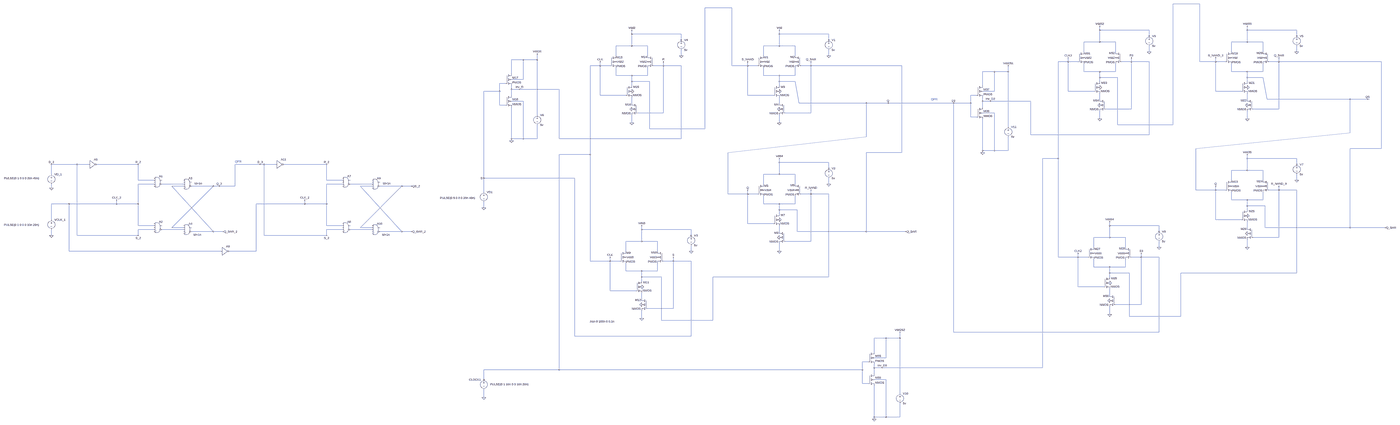
[diagram p0: schematic Flip-Flop-D-negedge.asc, whole sheet]
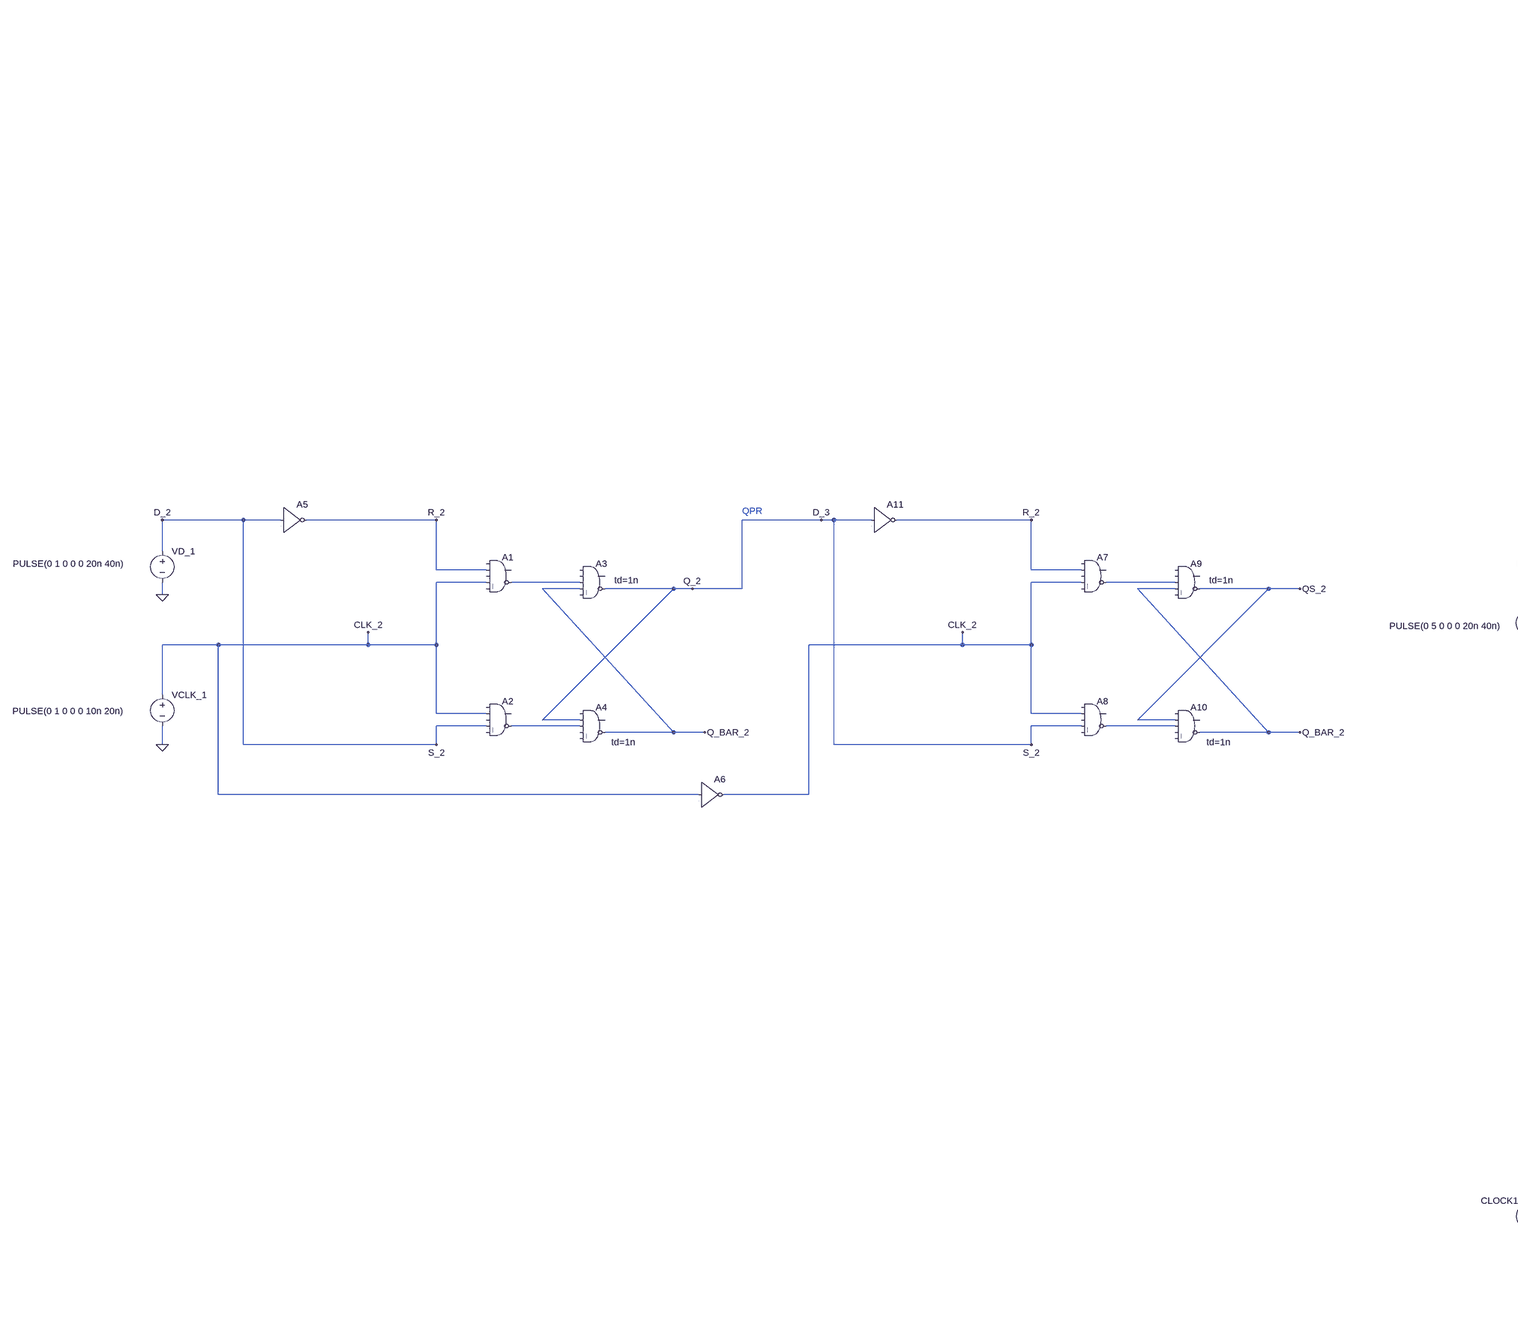
[diagram p1: schematic Flip-Flop-D-negedge.asc, part, row 1 of 1, column 1 of 3]
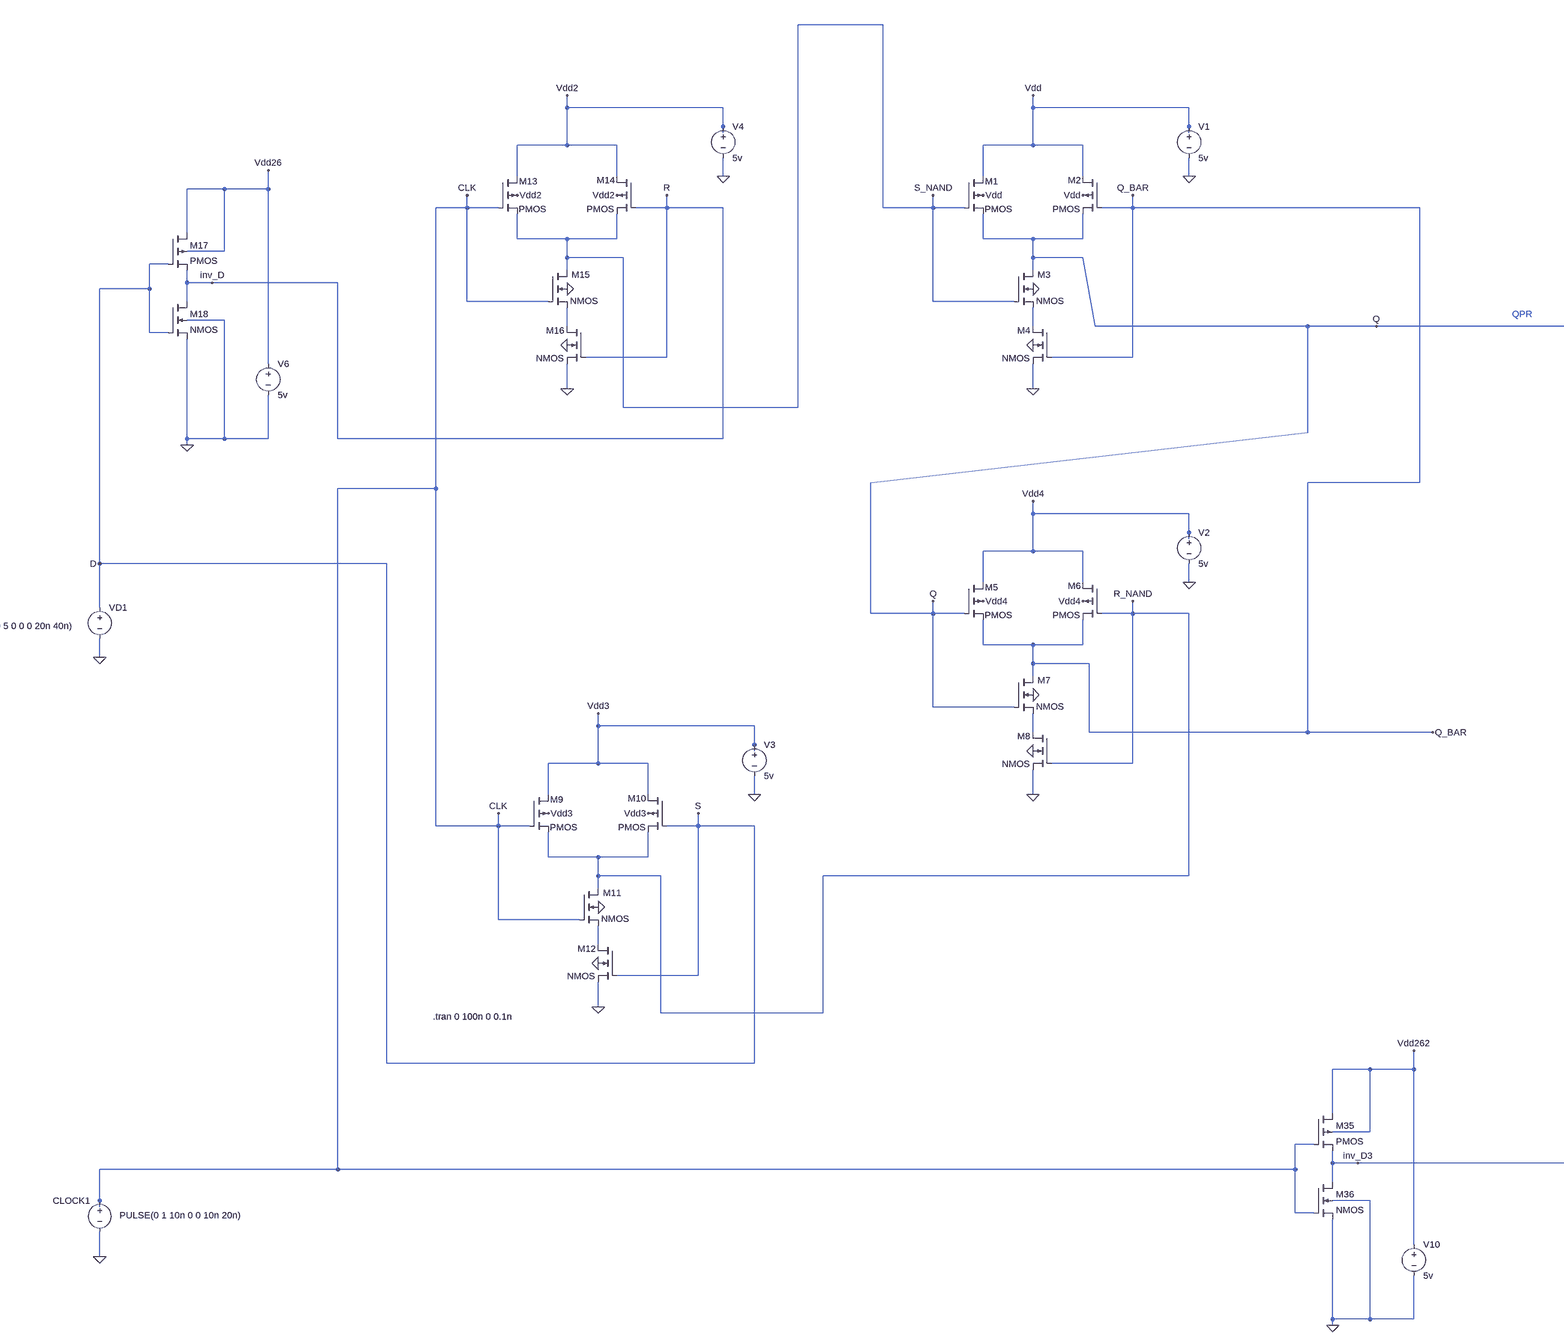
[diagram p2: schematic Flip-Flop-D-negedge.asc, part, row 1 of 1, column 2 of 3]
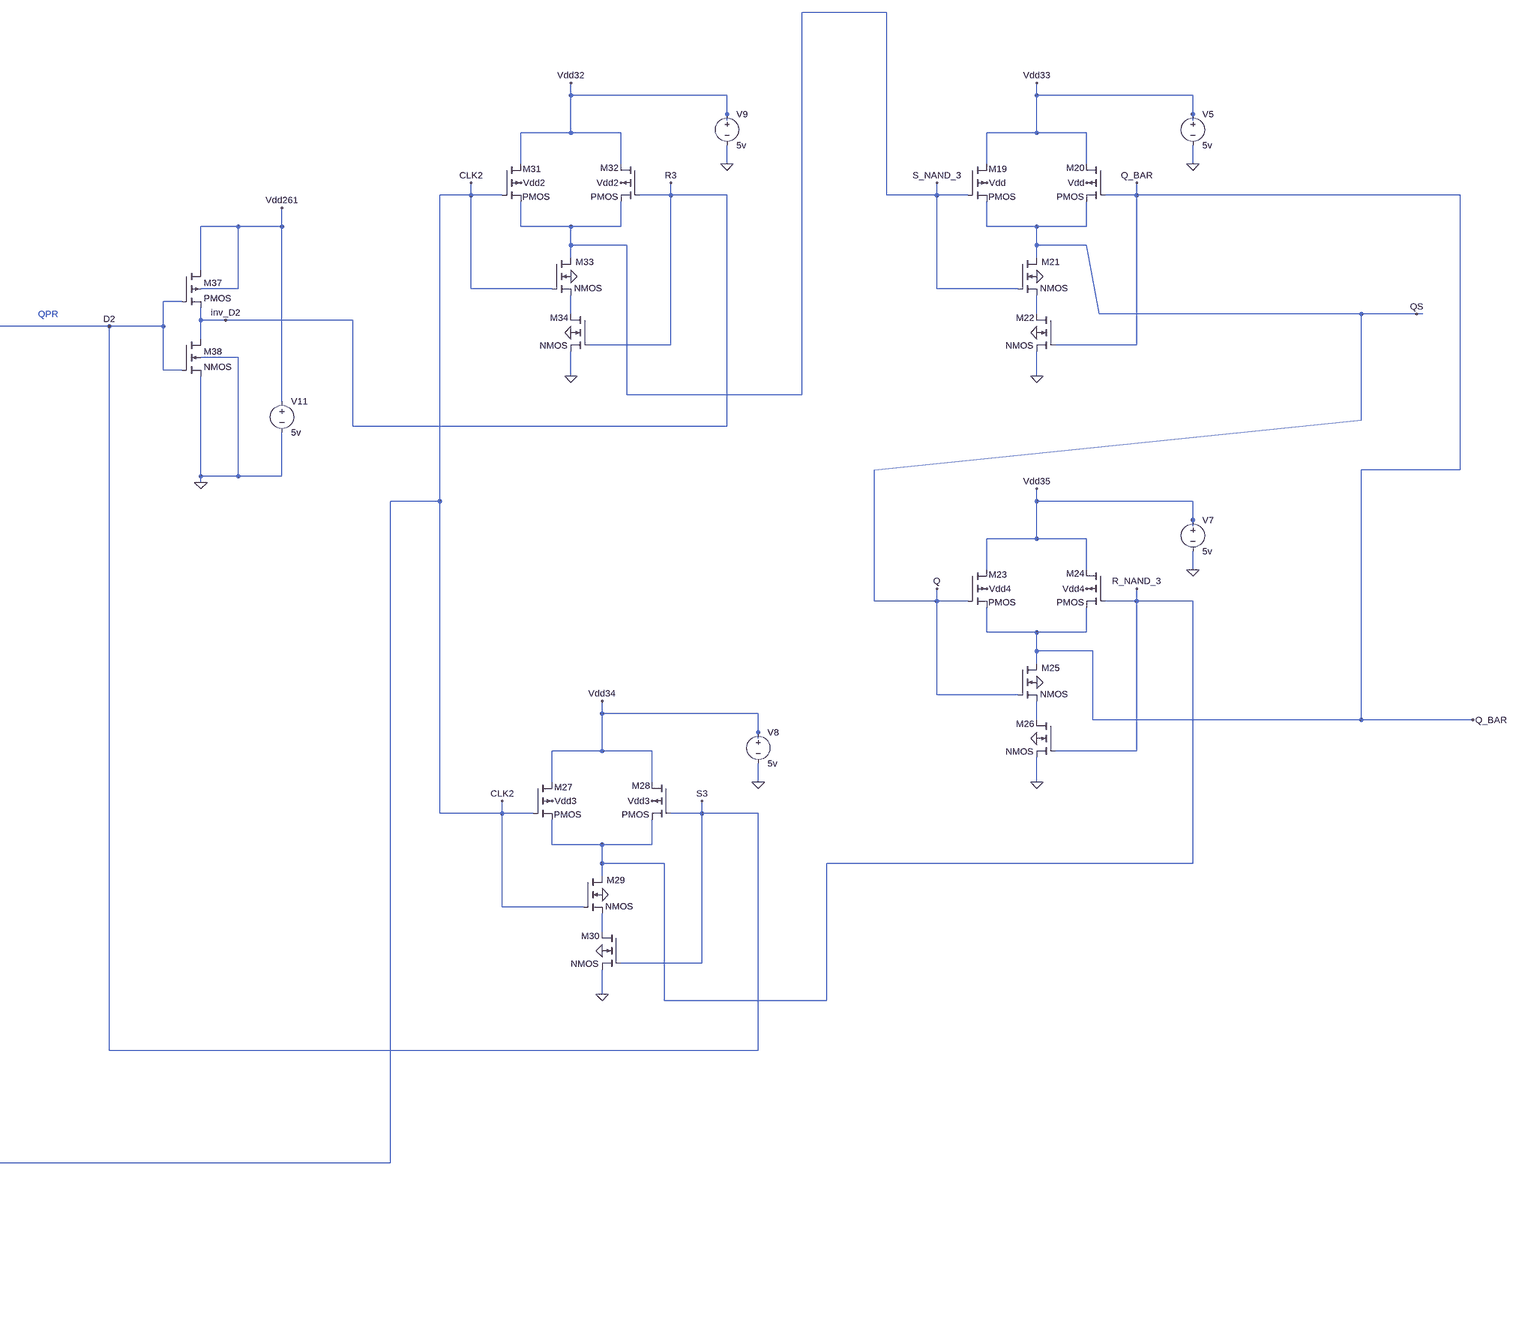
[diagram p3: schematic Flip-Flop-D-negedge.asc, part, row 1 of 1, column 3 of 3]
Flip-Flop-D-negedge.asc, the LTspice schematic file:
Version 4
SHEET 1 8836 2388
WIRE 7200 -1056 6352 -1056
WIRE 1920 -1024 1312 -1024
WIRE 5760 -784 5760 -816
WIRE 6160 -784 5760 -784
WIRE 7584 -784 7584 -816
WIRE 7984 -784 7584 -784
WIRE 720 -752 720 -784
WIRE 1120 -752 720 -752
WIRE 2304 -752 2304 -784
WIRE 2704 -752 2304 -752
WIRE 6160 -736 6160 -784
WIRE 7984 -736 7984 -784
WIRE 6160 -720 6160 -736
WIRE 7984 -720 7984 -736
WIRE 1120 -704 1120 -752
WIRE 2704 -704 2704 -752
WIRE 1120 -688 1120 -704
WIRE 2704 -688 2704 -704
WIRE 5760 -688 5760 -784
WIRE 5760 -688 5632 -688
WIRE 5888 -688 5760 -688
WIRE 7584 -688 7584 -784
WIRE 7584 -688 7456 -688
WIRE 7712 -688 7584 -688
WIRE 720 -656 720 -752
WIRE 720 -656 592 -656
WIRE 848 -656 720 -656
WIRE 2304 -656 2304 -752
WIRE 2304 -656 2176 -656
WIRE 2432 -656 2304 -656
WIRE 5632 -608 5632 -688
WIRE 5888 -608 5888 -688
WIRE 6160 -608 6160 -656
WIRE 7456 -608 7456 -688
WIRE 7712 -608 7712 -688
WIRE 7984 -608 7984 -656
WIRE 592 -576 592 -656
WIRE 848 -576 848 -656
WIRE 1120 -576 1120 -624
WIRE 2176 -576 2176 -656
WIRE 2432 -576 2432 -656
WIRE 2704 -576 2704 -624
WIRE -544 -544 -640 -544
WIRE -432 -544 -432 -592
WIRE -432 -544 -544 -544
WIRE 5504 -528 5504 -560
WIRE 5504 -528 5424 -528
WIRE 5584 -528 5504 -528
WIRE 6016 -528 6016 -560
WIRE 6016 -528 5936 -528
WIRE 6160 -528 6016 -528
WIRE 7200 -528 7200 -1056
WIRE 7328 -528 7328 -560
WIRE 7328 -528 7200 -528
WIRE 7408 -528 7328 -528
WIRE 7840 -528 7840 -560
WIRE 7840 -528 7760 -528
WIRE 8704 -528 7840 -528
WIRE 464 -496 464 -528
WIRE 464 -496 384 -496
WIRE 544 -496 464 -496
WIRE 976 -496 976 -528
WIRE 976 -496 896 -496
WIRE 1120 -496 976 -496
WIRE 1920 -496 1920 -1024
WIRE 2048 -496 2048 -528
WIRE 2048 -496 1920 -496
WIRE 2128 -496 2048 -496
WIRE 2560 -496 2560 -528
WIRE 2560 -496 2480 -496
WIRE 3296 -496 2560 -496
WIRE 4208 -448 4112 -448
WIRE 4320 -448 4320 -496
WIRE 4320 -448 4208 -448
WIRE 5632 -448 5632 -512
WIRE 5760 -448 5632 -448
WIRE 5888 -448 5888 -512
WIRE 5888 -448 5760 -448
WIRE 7456 -448 7456 -512
WIRE 7584 -448 7456 -448
WIRE 7712 -448 7712 -512
WIRE 7712 -448 7584 -448
WIRE -640 -432 -640 -544
WIRE 592 -416 592 -480
WIRE 720 -416 592 -416
WIRE 848 -416 848 -480
WIRE 848 -416 720 -416
WIRE 2176 -416 2176 -480
WIRE 2304 -416 2176 -416
WIRE 2432 -416 2432 -480
WIRE 2432 -416 2304 -416
WIRE 5760 -400 5760 -448
WIRE 5904 -400 5760 -400
WIRE 7584 -400 7584 -448
WIRE 7712 -400 7584 -400
WIRE -544 -384 -544 -544
WIRE -544 -384 -640 -384
WIRE 720 -368 720 -416
WIRE 864 -368 720 -368
WIRE 2304 -368 2304 -416
WIRE 2432 -368 2304 -368
WIRE 5760 -368 5760 -400
WIRE 7584 -368 7584 -400
WIRE -688 -352 -736 -352
WIRE 720 -336 720 -368
WIRE 2304 -336 2304 -368
WIRE 4112 -336 4112 -448
WIRE -640 -304 -640 -336
WIRE -576 -304 -640 -304
WIRE -96 -304 -576 -304
WIRE -736 -288 -736 -352
WIRE -736 -288 -864 -288
WIRE 4208 -288 4208 -448
WIRE 4208 -288 4112 -288
WIRE 5504 -288 5504 -528
WIRE 5712 -288 5504 -288
WIRE 7328 -288 7328 -528
WIRE 7536 -288 7328 -288
WIRE -640 -256 -640 -304
WIRE 464 -256 464 -496
WIRE 672 -256 464 -256
WIRE 2048 -256 2048 -496
WIRE 2256 -256 2048 -256
WIRE 4064 -256 4016 -256
WIRE 5760 -224 5760 -272
WIRE 7584 -224 7584 -272
WIRE 7744 -224 7712 -400
WIRE 8416 -224 7744 -224
WIRE 8592 -224 8416 -224
WIRE 8608 -224 8592 -224
WIRE -544 -208 -640 -208
WIRE 4112 -208 4112 -240
WIRE 4176 -208 4112 -208
WIRE 4944 -208 4176 -208
WIRE 720 -192 720 -240
WIRE 2304 -192 2304 -240
WIRE 2464 -192 2432 -368
WIRE 3008 -192 2464 -192
WIRE 3184 -192 3008 -192
WIRE 3872 -192 3184 -192
WIRE 4016 -192 4016 -256
WIRE 4016 -192 3872 -192
WIRE -736 -176 -736 -288
WIRE -688 -176 -736 -176
WIRE 4112 -160 4112 -208
WIRE 6016 -144 6016 -528
WIRE 6016 -144 5808 -144
WIRE 7840 -144 7840 -528
WIRE 7840 -144 7632 -144
WIRE 976 -112 976 -496
WIRE 976 -112 768 -112
WIRE 2560 -112 2560 -496
WIRE 2560 -112 2352 -112
WIRE 4208 -112 4112 -112
WIRE -432 -96 -432 -544
WIRE 4016 -80 4016 -192
WIRE 4064 -80 4016 -80
WIRE 5760 -64 5760 -128
WIRE 7584 -64 7584 -128
WIRE 720 -32 720 -96
WIRE 2304 -32 2304 -96
WIRE 5904 -16 5904 -400
WIRE 6352 -16 6352 -1056
WIRE 6352 -16 5904 -16
WIRE 4320 0 4320 -448
WIRE 864 16 864 -368
WIRE 1312 16 1312 -1024
WIRE 1312 16 864 16
WIRE 8416 48 8416 -224
WIRE 4944 64 4944 -208
WIRE 6160 64 6160 -528
WIRE 6160 64 4944 64
WIRE 3008 80 3008 -192
WIRE -640 96 -640 -160
WIRE -544 96 -544 -208
WIRE -544 96 -640 96
WIRE -432 96 -432 -16
WIRE -432 96 -544 96
WIRE -96 96 -96 -304
WIRE 1120 96 1120 -496
WIRE 1120 96 -96 96
WIRE -640 112 -640 96
WIRE 7168 176 8416 48
WIRE 8704 176 8704 -528
WIRE 8704 176 8416 176
WIRE 4112 192 4112 -64
WIRE 4208 192 4208 -112
WIRE 4208 192 4112 192
WIRE 4320 192 4320 80
WIRE 4320 192 4208 192
WIRE 1888 208 3008 80
WIRE 3296 208 3296 -496
WIRE 3296 208 3008 208
WIRE 4112 208 4112 192
WIRE 384 224 384 -496
WIRE 384 224 -96 224
WIRE 5424 256 5424 -528
WIRE 5424 256 5040 256
WIRE 7584 256 7584 224
WIRE 7984 256 7584 256
WIRE 2304 288 2304 256
WIRE 2704 288 2304 288
WIRE -7376 304 -7584 304
WIRE -7280 304 -7376 304
WIRE -6768 304 -7216 304
WIRE -5712 304 -5984 304
WIRE -5680 304 -5712 304
WIRE -5584 304 -5680 304
WIRE -5072 304 -5520 304
WIRE 7984 304 7984 256
WIRE 7984 320 7984 304
WIRE 2704 336 2704 288
WIRE 2704 352 2704 336
WIRE 7584 352 7584 256
WIRE 7584 352 7456 352
WIRE 7712 352 7584 352
WIRE -7584 384 -7584 304
WIRE 2304 384 2304 288
WIRE 2304 384 2176 384
WIRE 2432 384 2304 384
WIRE -864 416 -864 -288
WIRE 64 416 -864 416
WIRE -6768 432 -6768 304
WIRE -6640 432 -6768 432
WIRE -5072 432 -5072 304
WIRE -4944 432 -5072 432
WIRE 7456 432 7456 352
WIRE 7712 432 7712 352
WIRE 7984 432 7984 384
WIRE -6640 464 -6768 464
WIRE -6400 464 -6576 464
WIRE -4944 464 -5072 464
WIRE -4704 464 -4880 464
WIRE 2176 464 2176 384
WIRE 2432 464 2432 384
WIRE 2704 464 2704 416
WIRE -6400 480 -6496 480
WIRE -6160 480 -6336 480
WIRE -6112 480 -6160 480
WIRE -5984 480 -5984 304
WIRE -5984 480 -6112 480
WIRE -4704 480 -4800 480
WIRE -4464 480 -4640 480
WIRE -4384 480 -4464 480
WIRE -7584 496 -7584 464
WIRE 7168 512 7168 176
WIRE 7328 512 7328 480
WIRE 7328 512 7168 512
WIRE 7408 512 7328 512
WIRE 7840 512 7840 480
WIRE 7840 512 7760 512
WIRE 7984 512 7840 512
WIRE -864 528 -864 416
WIRE 1888 544 1888 208
WIRE 2048 544 2048 512
WIRE 2048 544 1888 544
WIRE 2128 544 2048 544
WIRE 2560 544 2560 512
WIRE 2560 544 2480 544
WIRE 2704 544 2560 544
WIRE 7456 592 7456 528
WIRE 7584 592 7456 592
WIRE 7712 592 7712 528
WIRE 7712 592 7584 592
WIRE -7440 624 -7584 624
WIRE -6960 624 -6960 592
WIRE -6960 624 -7440 624
WIRE -6768 624 -6768 464
WIRE -6768 624 -6960 624
WIRE -5264 624 -5264 592
WIRE -5264 624 -5744 624
WIRE -5072 624 -5072 464
WIRE -5072 624 -5264 624
WIRE 2176 624 2176 560
WIRE 2304 624 2176 624
WIRE 2432 624 2432 560
WIRE 2432 624 2304 624
WIRE 7584 640 7584 592
WIRE 7728 640 7584 640
WIRE -864 656 -864 608
WIRE 2304 672 2304 624
WIRE 2448 672 2304 672
WIRE 7584 672 7584 640
WIRE 2304 704 2304 672
WIRE -7584 752 -7584 624
WIRE 7328 752 7328 512
WIRE 7536 752 7328 752
WIRE 2048 784 2048 544
WIRE 2256 784 2048 784
WIRE -6768 800 -6768 624
WIRE -6640 800 -6768 800
WIRE -5072 800 -5072 624
WIRE -4944 800 -5072 800
WIRE 5840 800 5840 768
WIRE 6240 800 5840 800
WIRE -6496 816 -6160 480
WIRE -6400 816 -6496 816
WIRE -4800 816 -4464 480
WIRE -4704 816 -4800 816
WIRE 7584 816 7584 768
WIRE 7728 816 7728 640
WIRE 8416 816 8416 176
WIRE 8416 816 7728 816
WIRE 8736 816 8416 816
WIRE -6640 832 -6768 832
WIRE -6400 832 -6576 832
WIRE -4944 832 -5072 832
WIRE -4704 832 -4880 832
WIRE 800 832 800 800
WIRE 1200 832 800 832
WIRE -6160 848 -6496 480
WIRE -6160 848 -6336 848
WIRE -6080 848 -6160 848
WIRE -4464 848 -4800 480
WIRE -4464 848 -4640 848
WIRE -4384 848 -4464 848
WIRE 2304 848 2304 800
WIRE 2448 848 2448 672
WIRE 3008 848 3008 208
WIRE 3008 848 2448 848
WIRE 3328 848 3008 848
WIRE 6240 848 6240 800
WIRE 6240 864 6240 848
WIRE -7584 880 -7584 832
WIRE -7376 880 -7376 304
WIRE -6768 880 -6768 832
WIRE -6768 880 -7376 880
WIRE -5680 880 -5680 304
WIRE -5072 880 -5072 832
WIRE -5072 880 -5680 880
WIRE 1200 880 1200 832
WIRE 1200 896 1200 880
WIRE 5840 896 5840 800
WIRE 5840 896 5712 896
WIRE 5968 896 5840 896
WIRE 7840 896 7840 512
WIRE 7840 896 7632 896
WIRE 800 928 800 832
WIRE 800 928 672 928
WIRE 928 928 800 928
WIRE 2560 928 2560 544
WIRE 2560 928 2352 928
WIRE 5712 976 5712 896
WIRE 5968 976 5968 896
WIRE 6240 976 6240 928
WIRE 7584 976 7584 912
WIRE -7440 1008 -7440 624
WIRE -6096 1008 -7440 1008
WIRE -5744 1008 -5744 624
WIRE -5744 1008 -6032 1008
WIRE 672 1008 672 928
WIRE 928 1008 928 928
WIRE 1200 1008 1200 960
WIRE 2304 1008 2304 944
WIRE 5424 1056 5424 256
WIRE 5584 1056 5584 1024
WIRE 5584 1056 5424 1056
WIRE 5664 1056 5584 1056
WIRE 6096 1056 6096 1024
WIRE 6096 1056 6016 1056
WIRE 6240 1056 6096 1056
WIRE 384 1088 384 224
WIRE 544 1088 544 1056
WIRE 544 1088 384 1088
WIRE 624 1088 544 1088
WIRE 1056 1088 1056 1056
WIRE 1056 1088 976 1088
WIRE 1200 1088 1056 1088
WIRE 5712 1136 5712 1072
WIRE 5840 1136 5712 1136
WIRE 5968 1136 5968 1072
WIRE 5968 1136 5840 1136
WIRE 672 1168 672 1104
WIRE 800 1168 672 1168
WIRE 928 1168 928 1104
WIRE 928 1168 800 1168
WIRE 5840 1184 5840 1136
WIRE 6000 1184 5840 1184
WIRE 7984 1184 7984 512
WIRE 7984 1184 6416 1184
WIRE 800 1216 800 1168
WIRE 960 1216 800 1216
WIRE 2704 1216 2704 544
WIRE 2704 1216 1376 1216
WIRE 5840 1216 5840 1184
WIRE 800 1248 800 1216
WIRE 5584 1296 5584 1056
WIRE 5792 1296 5584 1296
WIRE 544 1328 544 1088
WIRE 752 1328 544 1328
WIRE 5840 1360 5840 1312
WIRE 800 1392 800 1344
WIRE 6096 1440 6096 1056
WIRE 6096 1440 5888 1440
WIRE 1056 1472 1056 1088
WIRE 1056 1472 848 1472
WIRE 5840 1520 5840 1456
WIRE 6000 1536 6000 1184
WIRE 6416 1536 6416 1184
WIRE 6416 1536 6000 1536
WIRE 800 1552 800 1488
WIRE 960 1568 960 1216
WIRE 1376 1568 1376 1216
WIRE 1376 1568 960 1568
WIRE 3872 1664 3872 -192
WIRE 6240 1664 6240 1056
WIRE 6240 1664 3872 1664
WIRE 64 1696 64 416
WIRE 1200 1696 1200 1088
WIRE 1200 1696 64 1696
WIRE 3168 1712 3072 1712
WIRE 3280 1712 3280 1664
WIRE 3280 1712 3168 1712
WIRE 3072 1824 3072 1712
WIRE 3168 1872 3168 1712
WIRE 3168 1872 3072 1872
WIRE 3024 1904 2976 1904
WIRE 3072 1952 3072 1920
WIRE 3136 1952 3072 1952
WIRE 5040 1952 5040 256
WIRE 5040 1952 3136 1952
WIRE -96 1968 -96 224
WIRE -96 1968 -864 1968
WIRE 2976 1968 2976 1904
WIRE 2976 1968 -96 1968
WIRE 3072 2000 3072 1952
WIRE -864 2048 -864 1968
WIRE 3168 2048 3072 2048
WIRE -864 2064 -864 2048
WIRE 2976 2080 2976 1968
WIRE 3024 2080 2976 2080
WIRE 3280 2160 3280 1712
WIRE -864 2192 -864 2128
WIRE 3072 2352 3072 2096
WIRE 3168 2352 3168 2048
WIRE 3168 2352 3072 2352
WIRE 3280 2352 3280 2240
WIRE 3280 2352 3168 2352
WIRE 3072 2368 3072 2352
FLAG 2304 -32 0
FLAG 2304 -784 Vdd
FLAG 2176 -528 Vdd
FLAG 2432 -528 Vdd
FLAG 2048 -528 S_NAND
FLAG 2560 -528 Q_BAR
FLAG 2704 -576 0
FLAG 2304 -288 0
FLAG 2304 -144 0
FLAG 2304 1008 0
FLAG 2304 256 Vdd4
FLAG 2176 512 Vdd4
FLAG 2432 512 Vdd4
FLAG 2048 512 Q
FLAG 2560 512 R_NAND
FLAG 2704 464 0
FLAG 2304 752 0
FLAG 2304 896 0
FLAG 3184 -192 Q
FLAG 3328 848 Q_BAR
FLAG 800 1552 0
FLAG 800 800 Vdd3
FLAG 672 1056 Vdd3
FLAG 928 1056 Vdd3
FLAG 544 1056 CLK
FLAG 1056 1056 S
FLAG 1200 1008 0
FLAG 800 1296 0
FLAG 800 1440 0
FLAG 720 -32 0
FLAG -864 656 0
FLAG -864 2192 0
FLAG 720 -784 Vdd2
FLAG 592 -528 Vdd2
FLAG 848 -528 Vdd2
FLAG 464 -528 CLK
FLAG 976 -528 R
FLAG 1120 -576 0
FLAG 720 -288 0
FLAG 720 -144 0
FLAG -6112 480 Q_2
FLAG -6080 848 Q_BAR_2
FLAG -7584 880 0
FLAG -6960 592 CLK_2
FLAG -7584 496 0
FLAG -6768 304 R_2
FLAG -6768 880 S_2
FLAG -7584 304 D_2
FLAG -640 112 0
FLAG -432 -592 Vdd26
FLAG -576 -304 inv_D
FLAG -864 416 D
FLAG -4384 480 QS_2
FLAG -4384 848 Q_BAR_2
FLAG -5264 592 CLK_2
FLAG -5072 304 R_2
FLAG -5072 880 S_2
FLAG -5712 304 D_3
FLAG 7584 -64 0
FLAG 7584 -816 Vdd33
FLAG 7456 -560 Vdd
FLAG 7712 -560 Vdd
FLAG 7328 -560 S_NAND_3
FLAG 7840 -560 Q_BAR
FLAG 7984 -608 0
FLAG 7584 -320 0
FLAG 7584 -176 0
FLAG 7584 976 0
FLAG 7584 224 Vdd35
FLAG 7456 480 Vdd4
FLAG 7712 480 Vdd4
FLAG 7328 480 Q
FLAG 7840 480 R_NAND_3
FLAG 7984 432 0
FLAG 7584 720 0
FLAG 7584 864 0
FLAG 8592 -224 QS
FLAG 8736 816 Q_BAR
FLAG 5840 1520 0
FLAG 5840 768 Vdd34
FLAG 5712 1024 Vdd3
FLAG 5968 1024 Vdd3
FLAG 5584 1024 CLK2
FLAG 6096 1024 S3
FLAG 6240 976 0
FLAG 5840 1264 0
FLAG 5840 1408 0
FLAG 5760 -64 0
FLAG 5760 -816 Vdd32
FLAG 5632 -560 Vdd2
FLAG 5888 -560 Vdd2
FLAG 5504 -560 CLK2
FLAG 6016 -560 R3
FLAG 6160 -608 0
FLAG 5760 -320 0
FLAG 5760 -176 0
FLAG 3072 2368 0
FLAG 3280 1664 Vdd262
FLAG 3136 1952 inv_D3
FLAG 4112 208 0
FLAG 4320 -496 Vdd261
FLAG 4176 -208 inv_D2
FLAG 3872 -192 D2
SYMBOL pmos4 2128 -576 R0
WINDOW 0 53 12 Left 2
WINDOW 3 52 83 Left 2
SYMATTR InstName M1
SYMATTR Value2 l=0.6u w=6u
SYMBOL pmos4 2480 -576 M0
WINDOW 0 53 9 Left 2
WINDOW 3 55 83 Left 2
SYMATTR InstName M2
SYMATTR Value2 l=0.6u w=6u
SYMBOL nmos4 2256 -336 R0
WINDOW 0 60 11 Left 2
WINDOW 3 56 78 Left 2
SYMATTR InstName M3
SYMATTR Value2 l=0.6u w=3u
SYMBOL nmos4 2352 -192 M0
WINDOW 0 54 10 Left 2
WINDOW 3 56 81 Left 2
SYMATTR InstName M4
SYMATTR Value2 l=0.6u w=3u
SYMBOL voltage 2704 -720 R0
WINDOW 123 0 0 Left 0
WINDOW 39 0 0 Left 0
SYMATTR InstName V1
SYMATTR Value 5v
SYMBOL pmos4 2128 464 R0
WINDOW 0 53 12 Left 2
WINDOW 3 52 83 Left 2
SYMATTR InstName M5
SYMATTR Value2 l=0.6u w=6u
SYMBOL pmos4 2480 464 M0
WINDOW 0 53 9 Left 2
WINDOW 3 55 83 Left 2
SYMATTR InstName M6
SYMATTR Value2 l=0.6u w=6u
SYMBOL nmos4 2256 704 R0
WINDOW 0 60 11 Left 2
WINDOW 3 56 78 Left 2
SYMATTR InstName M7
SYMATTR Value2 l=0.6u w=3u
SYMBOL nmos4 2352 848 M0
WINDOW 0 54 10 Left 2
WINDOW 3 56 81 Left 2
SYMATTR InstName M8
SYMATTR Value2 l=0.6u w=3u
SYMBOL voltage 2704 320 R0
WINDOW 123 0 0 Left 0
WINDOW 39 0 0 Left 0
SYMATTR InstName V2
SYMATTR Value 5v
SYMBOL pmos4 624 1008 R0
WINDOW 0 53 12 Left 2
WINDOW 3 52 83 Left 2
SYMATTR InstName M9
SYMATTR Value2 l=0.6u w=6u
SYMBOL pmos4 976 1008 M0
WINDOW 0 53 9 Left 2
WINDOW 3 55 83 Left 2
SYMATTR InstName M10
SYMATTR Value2 l=0.6u w=6u
SYMBOL nmos4 752 1248 R0
WINDOW 0 60 11 Left 2
WINDOW 3 56 78 Left 2
SYMATTR InstName M11
SYMATTR Value2 l=0.6u w=3u
SYMBOL nmos4 848 1392 M0
WINDOW 0 54 10 Left 2
WINDOW 3 56 81 Left 2
SYMATTR InstName M12
SYMATTR Value2 l=0.6u w=3u
SYMBOL voltage 1200 864 R0
WINDOW 123 0 0 Left 0
WINDOW 39 0 0 Left 0
SYMATTR InstName V3
SYMATTR Value 5v
SYMBOL voltage -864 2032 M0
WINDOW 3 -361 53 Left 2
WINDOW 123 0 0 Left 0
WINDOW 39 0 0 Left 0
SYMATTR Value PULSE(0 1 10n 0 0 10n 20n)
SYMATTR InstName CLOCK1
SYMBOL pmos4 544 -576 R0
WINDOW 0 53 12 Left 2
WINDOW 3 52 83 Left 2
SYMATTR InstName M13
SYMATTR Value2 l=0.6u w=6u
SYMBOL pmos4 896 -576 M0
WINDOW 0 53 9 Left 2
WINDOW 3 55 83 Left 2
SYMATTR InstName M14
SYMATTR Value2 l=0.6u w=6u
SYMBOL nmos4 672 -336 R0
WINDOW 0 60 11 Left 2
WINDOW 3 56 78 Left 2
SYMATTR InstName M15
SYMATTR Value2 l=0.6u w=3u
SYMBOL nmos4 768 -192 M0
WINDOW 0 54 10 Left 2
WINDOW 3 56 81 Left 2
SYMATTR InstName M16
SYMATTR Value2 l=0.6u w=3u
SYMBOL voltage 1120 -720 R0
WINDOW 123 0 0 Left 0
WINDOW 39 0 0 Left 0
SYMATTR InstName V4
SYMATTR Value 5v
SYMBOL voltage -864 512 R0
WINDOW 3 -71 63 Right 2
WINDOW 123 0 0 Left 0
WINDOW 39 0 0 Left 0
SYMATTR Value PULSE(0 5 0 0 0 20n 40n)
SYMATTR InstName VD1
SYMBOL voltage -7584 736 R0
WINDOW 3 -384 57 Left 2
WINDOW 123 0 0 Left 0
WINDOW 39 0 0 Left 0
SYMATTR Value PULSE(0 1 0 0 0 10n 20n)
SYMATTR InstName VCLK_1
SYMBOL Digital\\and -6608 384 R0
SYMATTR InstName A1
SYMBOL Digital\\and -6608 752 R0
SYMATTR InstName A2
SYMBOL Digital\\and -6368 400 R0
WINDOW 3 56 58 Left 2
SYMATTR Value td=1n
SYMATTR InstName A3
SYMBOL Digital\\and -6368 768 R0
WINDOW 3 49 105 Left 2
SYMATTR Value td=1n
SYMATTR InstName A4
SYMBOL voltage -7584 368 R0
WINDOW 3 -383 48 Left 2
WINDOW 123 0 0 Left 0
WINDOW 39 0 0 Left 0
SYMATTR Value PULSE(0 1 0 0 0 20n 40n)
SYMATTR InstName VD_1
SYMBOL Digital\\inv -7280 240 R0
SYMATTR InstName A5
SYMBOL pmos4 -688 -432 R0
SYMATTR InstName M17
SYMATTR Value2 l=0.6u w=6u
SYMBOL nmos4 -688 -256 R0
SYMATTR InstName M18
SYMATTR Value2 l=0.6u w=3u
SYMBOL voltage -432 -112 R0
WINDOW 123 0 0 Left 0
WINDOW 39 0 0 Left 0
SYMATTR InstName V6
SYMATTR Value 5v
SYMBOL Digital\\inv -6096 944 R0
SYMATTR InstName A6
SYMBOL Digital\\and -4912 384 R0
SYMATTR InstName A7
SYMBOL Digital\\and -4912 752 R0
SYMATTR InstName A8
SYMBOL Digital\\and -4672 400 R0
WINDOW 3 56 58 Left 2
SYMATTR Value td=1n
SYMATTR InstName A9
SYMBOL Digital\\and -4672 768 R0
WINDOW 3 49 105 Left 2
SYMATTR Value td=1n
SYMATTR InstName A10
SYMBOL Digital\\inv -5584 240 R0
SYMATTR InstName A11
SYMBOL pmos4 7408 -608 R0
WINDOW 0 53 12 Left 2
WINDOW 3 52 83 Left 2
SYMATTR InstName M19
SYMATTR Value2 l=0.6u w=6u
SYMBOL pmos4 7760 -608 M0
WINDOW 0 53 9 Left 2
WINDOW 3 55 83 Left 2
SYMATTR InstName M20
SYMATTR Value2 l=0.6u w=6u
SYMBOL nmos4 7536 -368 R0
WINDOW 0 60 11 Left 2
WINDOW 3 56 78 Left 2
SYMATTR InstName M21
SYMATTR Value2 l=0.6u w=3u
SYMBOL nmos4 7632 -224 M0
WINDOW 0 54 10 Left 2
WINDOW 3 56 81 Left 2
SYMATTR InstName M22
SYMATTR Value2 l=0.6u w=3u
SYMBOL voltage 7984 -752 R0
WINDOW 123 0 0 Left 0
WINDOW 39 0 0 Left 0
SYMATTR InstName V5
SYMATTR Value 5v
SYMBOL pmos4 7408 432 R0
WINDOW 0 53 12 Left 2
WINDOW 3 52 83 Left 2
SYMATTR InstName M23
SYMATTR Value2 l=0.6u w=6u
SYMBOL pmos4 7760 432 M0
WINDOW 0 53 9 Left 2
WINDOW 3 55 83 Left 2
SYMATTR InstName M24
SYMATTR Value2 l=0.6u w=6u
SYMBOL nmos4 7536 672 R0
WINDOW 0 60 11 Left 2
WINDOW 3 56 78 Left 2
SYMATTR InstName M25
SYMATTR Value2 l=0.6u w=3u
SYMBOL nmos4 7632 816 M0
WINDOW 0 54 10 Left 2
WINDOW 3 56 81 Left 2
SYMATTR InstName M26
SYMATTR Value2 l=0.6u w=3u
SYMBOL voltage 7984 288 R0
WINDOW 123 0 0 Left 0
WINDOW 39 0 0 Left 0
SYMATTR InstName V7
SYMATTR Value 5v
SYMBOL pmos4 5664 976 R0
WINDOW 0 53 12 Left 2
WINDOW 3 52 83 Left 2
SYMATTR InstName M27
SYMATTR Value2 l=0.6u w=6u
SYMBOL pmos4 6016 976 M0
WINDOW 0 53 9 Left 2
WINDOW 3 55 83 Left 2
SYMATTR InstName M28
SYMATTR Value2 l=0.6u w=6u
SYMBOL nmos4 5792 1216 R0
WINDOW 0 60 11 Left 2
WINDOW 3 56 78 Left 2
SYMATTR InstName M29
SYMATTR Value2 l=0.6u w=3u
SYMBOL nmos4 5888 1360 M0
WINDOW 0 54 10 Left 2
WINDOW 3 56 81 Left 2
SYMATTR InstName M30
SYMATTR Value2 l=0.6u w=3u
SYMBOL voltage 6240 832 R0
WINDOW 123 0 0 Left 0
WINDOW 39 0 0 Left 0
SYMATTR InstName V8
SYMATTR Value 5v
SYMBOL pmos4 5584 -608 R0
WINDOW 0 53 12 Left 2
WINDOW 3 52 83 Left 2
SYMATTR InstName M31
SYMATTR Value2 l=0.6u w=6u
SYMBOL pmos4 5936 -608 M0
WINDOW 0 53 9 Left 2
WINDOW 3 55 83 Left 2
SYMATTR InstName M32
SYMATTR Value2 l=0.6u w=6u
SYMBOL nmos4 5712 -368 R0
WINDOW 0 60 11 Left 2
WINDOW 3 56 78 Left 2
SYMATTR InstName M33
SYMATTR Value2 l=0.6u w=3u
SYMBOL nmos4 5808 -224 M0
WINDOW 0 54 10 Left 2
WINDOW 3 56 81 Left 2
SYMATTR InstName M34
SYMATTR Value2 l=0.6u w=3u
SYMBOL voltage 6160 -752 R0
WINDOW 123 0 0 Left 0
WINDOW 39 0 0 Left 0
SYMATTR InstName V9
SYMATTR Value 5v
SYMBOL pmos4 3024 1824 R0
SYMATTR InstName M35
SYMATTR Value2 l=0.6u w=6u
SYMBOL nmos4 3024 2000 R0
SYMATTR InstName M36
SYMATTR Value2 l=0.6u w=3u
SYMBOL voltage 3280 2144 R0
WINDOW 123 0 0 Left 0
WINDOW 39 0 0 Left 0
SYMATTR InstName V10
SYMATTR Value 5v
SYMBOL pmos4 4064 -336 R0
SYMATTR InstName M37
SYMATTR Value2 l=0.6u w=6u
SYMBOL nmos4 4064 -160 R0
SYMATTR InstName M38
SYMATTR Value2 l=0.6u w=3u
SYMBOL voltage 4320 -16 R0
WINDOW 123 0 0 Left 0
WINDOW 39 0 0 Left 0
SYMATTR InstName V11
SYMATTR Value 5v
TEXT 376 1576 Left 2 !.tran 0 100n 0 0.1n
TEXT 3568 -224 Left 2 ;QPR
TEXT -5984 280 Left 2 ;QPR

The netlist it stands for:
* Flip-Flop-D-negedge.asc
M1 Vdd S_NAND D2 Vdd PMOS l=0.6u w=6u
M2 Vdd Q_BAR D2 Vdd PMOS l=0.6u w=6u
M3 D2 S_NAND N004 0 NMOS l=0.6u w=3u
M4 N004 Q_BAR 0 0 NMOS l=0.6u w=3u
V1 Vdd 0 5v
M5 Vdd4 D2 Q_BAR Vdd4 PMOS l=0.6u w=6u
M6 Vdd4 R_NAND Q_BAR Vdd4 PMOS l=0.6u w=6u
M7 Q_BAR D2 N010 0 NMOS l=0.6u w=3u
M8 N010 R_NAND 0 0 NMOS l=0.6u w=3u
V2 Vdd4 0 5v
M9 Vdd3 CLK R_NAND Vdd3 PMOS l=0.6u w=6u
M10 Vdd3 D R_NAND Vdd3 PMOS l=0.6u w=6u
M11 R_NAND CLK N012 0 NMOS l=0.6u w=3u
M12 N012 D 0 0 NMOS l=0.6u w=3u
V3 Vdd3 0 5v
V§CLOCK1 CLK 0 PULSE(0 1 10n 0 0 10n 20n)
M13 Vdd2 CLK S_NAND Vdd2 PMOS l=0.6u w=6u
M14 Vdd2 inv_D S_NAND Vdd2 PMOS l=0.6u w=6u
M15 S_NAND CLK N003 0 NMOS l=0.6u w=3u
M16 N003 inv_D 0 0 NMOS l=0.6u w=3u
V4 Vdd2 0 5v
VD1 D 0 PULSE(0 5 0 0 0 20n 40n)
VCLK_1 CLK_2 0 PULSE(0 1 0 0 0 10n 20n)
A1 0 R_2 0 CLK_2 0 N005 0 0 AND
A2 0 CLK_2 0 D_3 0 N008 0 0 AND
A3 0 0 N005 Q_BAR_2 0 D_3 0 0 AND td=1n
A4 0 D_3 N008 0 0 Q_BAR_2 0 0 AND td=1n
VD_1 D_3 0 PULSE(0 1 0 0 0 20n 40n)
A5 D_3 0 0 0 0 R_2 0 0 BUF
M17 Vdd26 D inv_D Vdd26 PMOS l=0.6u w=6u
M18 inv_D D 0 0 NMOS l=0.6u w=3u
V6 Vdd26 0 5v
A6 CLK_2 0 0 0 0 CLK_2 0 0 BUF
A7 0 R_2 0 CLK_2 0 N006 0 0 AND
A8 0 CLK_2 0 D_3 0 N009 0 0 AND
A9 0 0 N006 Q_BAR_2 0 QS_2 0 0 AND td=1n
A10 0 QS_2 N009 0 0 Q_BAR_2 0 0 AND td=1n
A11 D_3 0 0 0 0 R_2 0 0 BUF
M19 Vdd33 S_NAND_3 D2 Vdd PMOS l=0.6u w=6u
M20 Vdd33 Q_BAR D2 Vdd PMOS l=0.6u w=6u
M21 D2 S_NAND_3 N002 0 NMOS l=0.6u w=3u
M22 N002 Q_BAR 0 0 NMOS l=0.6u w=3u
V5 Vdd33 0 5v
M23 Vdd35 D2 Q_BAR Vdd4 PMOS l=0.6u w=6u
M24 Vdd35 R_NAND_3 Q_BAR Vdd4 PMOS l=0.6u w=6u
M25 Q_BAR D2 N007 0 NMOS l=0.6u w=3u
M26 N007 R_NAND_3 0 0 NMOS l=0.6u w=3u
V7 Vdd35 0 5v
M27 Vdd34 inv_D3 R_NAND_3 Vdd3 PMOS l=0.6u w=6u
M28 Vdd34 D2 R_NAND_3 Vdd3 PMOS l=0.6u w=6u
M29 R_NAND_3 inv_D3 N011 0 NMOS l=0.6u w=3u
M30 N011 D2 0 0 NMOS l=0.6u w=3u
V8 Vdd34 0 5v
M31 Vdd32 inv_D3 S_NAND_3 Vdd2 PMOS l=0.6u w=6u
M32 Vdd32 inv_D2 S_NAND_3 Vdd2 PMOS l=0.6u w=6u
M33 S_NAND_3 inv_D3 N001 0 NMOS l=0.6u w=3u
M34 N001 inv_D2 0 0 NMOS l=0.6u w=3u
V9 Vdd32 0 5v
M35 Vdd262 CLK inv_D3 Vdd262 PMOS l=0.6u w=6u
M36 inv_D3 CLK 0 0 NMOS l=0.6u w=3u
V10 Vdd262 0 5v
M37 Vdd261 D2 inv_D2 Vdd261 PMOS l=0.6u w=6u
M38 inv_D2 D2 0 0 NMOS l=0.6u w=3u
V11 Vdd261 0 5v
.model NMOS NMOS
.model PMOS PMOS
.lib standard.mos
.tran 0 100n 0 0.1n
* QPR
* QPR
.backanno
.end